# Altium schematic sheet Sheet1.SchDoc
size A; SheetNumber: 1; SheetTotal: 1
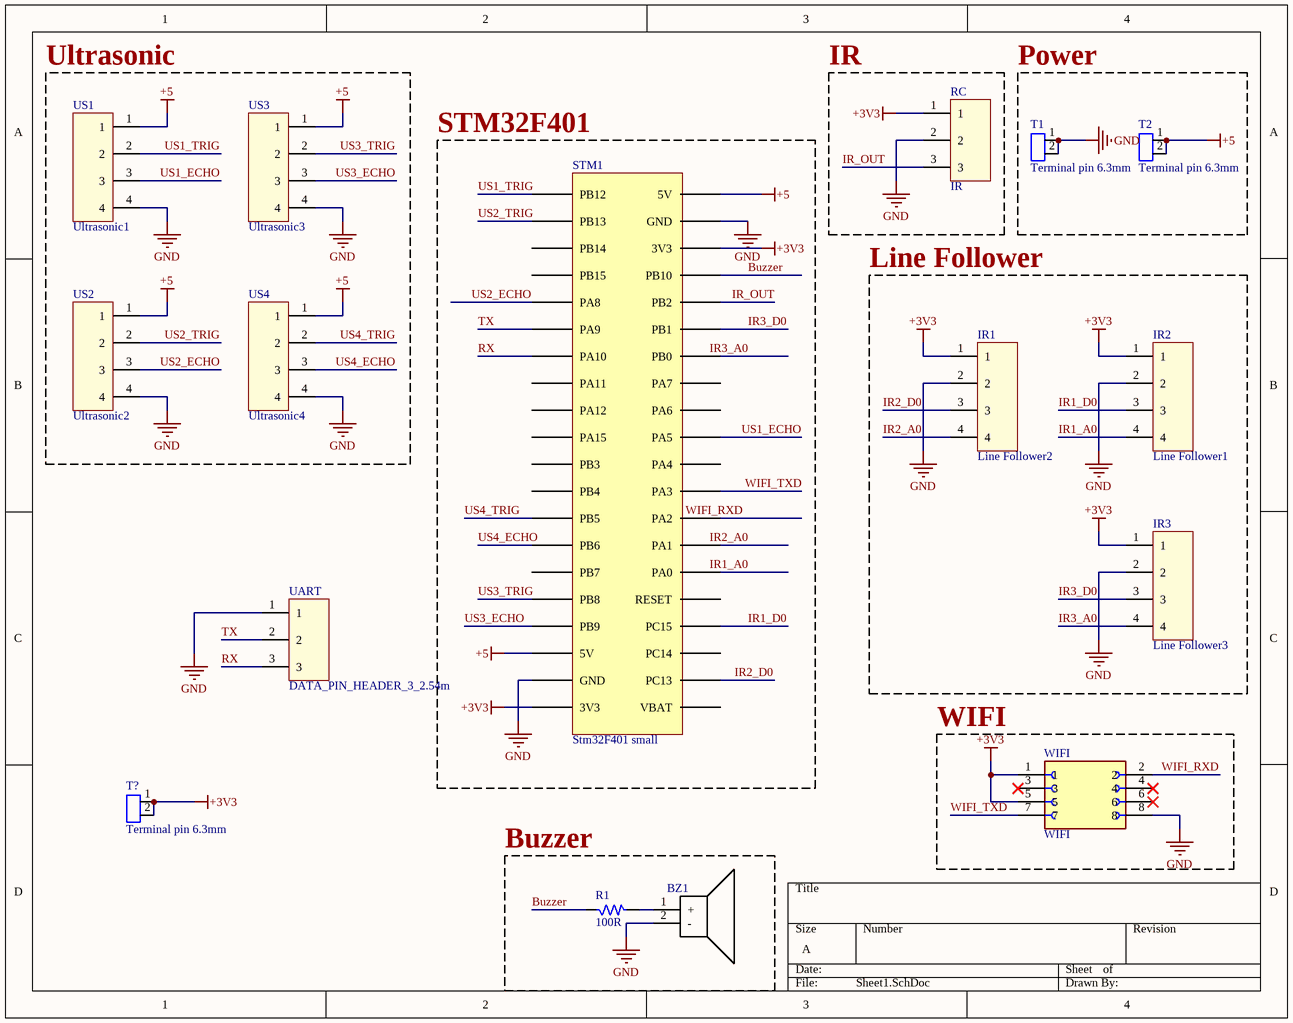
[diagram p0: Sheet1.SchDoc]

## Parts
BZ1  PS1440P02BT  [BUZZ_PS1440P02BT_TH]  (value not drawn)
IR1  Line Follower2  [DATA_PIN_HEADER_4_2.54m]
IR2  Line Follower1  [DATA_PIN_HEADER_4_2.54m]
IR3  Line Follower3  [DATA_PIN_HEADER_4_2.54m]
R1  100R  [RES_1206]
RC  IR  [Female_Header_3]
STM1  Stm32F401 small  [Stm32F401CCU6]
T1  Terminal pin 6.3mm  [Terminal pin 6.3mm]
T2  Terminal pin 6.3mm  [Terminal pin 6.3mm]
T?  Terminal pin 6.3mm  [Terminal pin 6.3mm]
UART  DATA_PIN_HEADER_3_2.54m  [DATA_PIN_HEADER_3_2.54m]
US1  Ultrasonic1  [DATA_PIN_HEADER_4_2.54m]
US2  Ultrasonic2  [DATA_PIN_HEADER_4_2.54m]
US3  Ultrasonic3  [DATA_PIN_HEADER_4_2.54m]
US4  Ultrasonic4  [DATA_PIN_HEADER_4_2.54m]
WIFI  WIFI  [SULLINS_PPPC042LFBN-RC]

## Blocks framed on the sheet
Ultrasonic: US1-US4
IR: RC
Power: T1 T2
STM32F401: STM1
Line Follower: IR1-IR3
WIFI: WIFI
Buzzer: BZ1 R1

## Nets
+3V3: IR1.1 IR2.1 IR3.1 RC.1 STM1.3V3 T?.1 T?.2 WIFI.1 WIFI.5
+5: STM1.5V T2.1 T2.2 US1.1 US2.1 US3.1 US4.1
GND: BZ1.2(-) IR1.2 IR2.2 IR3.2 RC.2 STM1.GND T1.1 T1.2 UART.1 US1.4 US2.4 US3.4 US4.4 WIFI.8
Buzzer: R1.1 STM1.PB10
IR1_A0: IR2.4 STM1.PA0
IR1_D0: IR2.3 STM1.PC15
IR2_A0: IR1.4 STM1.PA1
IR2_D0: IR1.3 STM1.PC13
IR3_A0: IR3.4 STM1.PB0
IR3_D0: IR3.3 STM1.PB1
IR_OUT: RC.3 STM1.PB2
RX: STM1.PA10 UART.3
TX: STM1.PA9 UART.2
US1_ECHO: STM1.PA5 US1.3
US1_TRIG: STM1.PB12 US1.2
US2_ECHO: STM1.PA8 US2.3
US2_TRIG: STM1.PB13 US2.2
US3_ECHO: STM1.PB9 US3.3
US3_TRIG: STM1.PB8 US3.2
US4_ECHO: STM1.PB6 US4.3
US4_TRIG: STM1.PB5 US4.2
WIFI_RXD: STM1.PA2 WIFI.2
WIFI_TXD: STM1.PA3 WIFI.7
NetBZ1_1: BZ1.1(+) R1.2

Not connected (* = marked no-connect by the designer): STM1 PA4 PA6 PA7 PA11 PA12 PA15 PB3 PB4 PB7 PB14 PB15 PC14 RESET VBAT; WIFI 3* 4* 6*

## Library data of the parts
BZ1 = BUZZ_PS1440P02BT-30V-TH: Buzzers Transducer, Externally Driven Piezo 3V  4kHz 75dB @ 3V, 10cm Through Hole PC Pins; Manufacturer: TDK Corporation; Alternate Part Number-1: NA; Manufacturer Part Number: PS1440P02BT; Case/Package: TH; Supplier-1: SP ROAD; Supplier Part Number-1: NA
IR1-IR3 US1-US4 = DATA_PIN_HEADER_4_2.54m
R1 = RES_10R-0.25W-5%-1206: 10 Ohms ±5% 0.25W, 1/4W Chip Resistor 1206 (3216 Metric) Automotive AEC-Q200 Thick Film; Manufacturer: Yageo; Manufacturer Part Number: RMCF1206JT10R0; Alternate Part Number-1: NA; Case/Package: 1206; Supplier-1: SIRICOM; Supplier Part Number-1: WR12X10R0FTL
RC = FEMALE_HEADER_3
WIFI = PPPC042LFBN-RC: 8 Position Total Dual Row 2.54 mm Pitch Straight Female Header; MF: Sullins Connector Solutions; MP: PPPC042LFBNRC; SnapEDA_Link: https://www.snapeda.com/parts/PPPC042LFBNRC/Sullins/view-part/?ref=snap; Package: None; Value: *; Check_prices: https://www.snapeda.com/parts/PPPC042LFBNRC/Sullins/view-part/?ref=eda